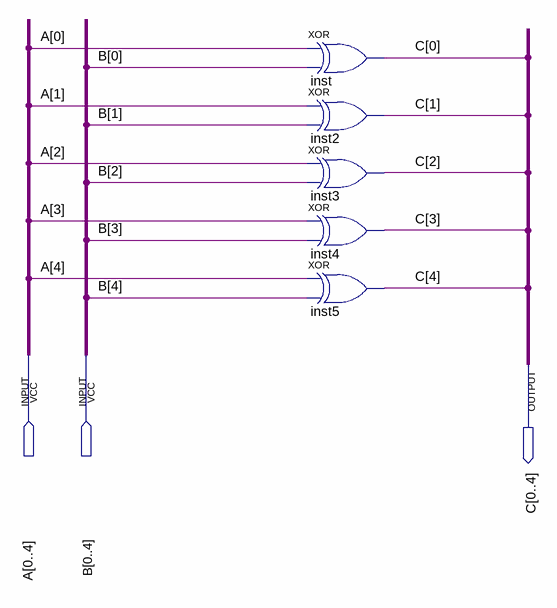
[diagram p0: schematic sheet]
// Quartus schematic xou.bdf as structural Verilog: 5 symbols, 3 pins
module xou (
  input  [0:4] A,
  input  [0:4] B,
  output [0:4] C
);

  xor inst (C[0], A[0], B[0]);
  xor inst2 (C[1], A[1], B[1]);
  xor inst3 (C[2], A[2], B[2]);
  xor inst4 (C[3], A[3], B[3]);
  xor inst5 (C[4], A[4], B[4]);
endmodule
